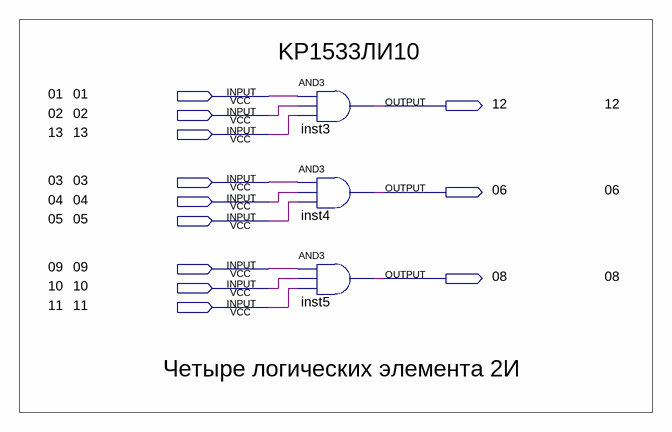
[diagram p0: schematic sheet]
// Quartus schematic KP1533LI10.bdf as structural Verilog: 3 symbols, 12 pins
module KP1533LI10 (
  input  \01 ,
  input  \02 ,
  input  \13 ,
  input  \03 ,
  input  \04 ,
  input  \05 ,
  input  \09 ,
  input  \10 ,
  input  \11 ,
  output \12 ,
  output \06 ,
  output \08 
);

  and inst3 (\12 , \01 , \02 , \13 );
  and inst4 (\06 , \03 , \04 , \05 );
  and inst5 (\08 , \09 , \10 , \11 );

  // Notes on the sheet:
  //   KP1533ЛИ10
  //   01
  //   12
  //   02
  //   13
  //   03
  //   06
  //   04
  //   05
  //   09
  //   08
  //   10
  //   11
  //   Четыре логических элемента 2И
endmodule
